# EAGLE board board1 (EAGLE 6.6.0)
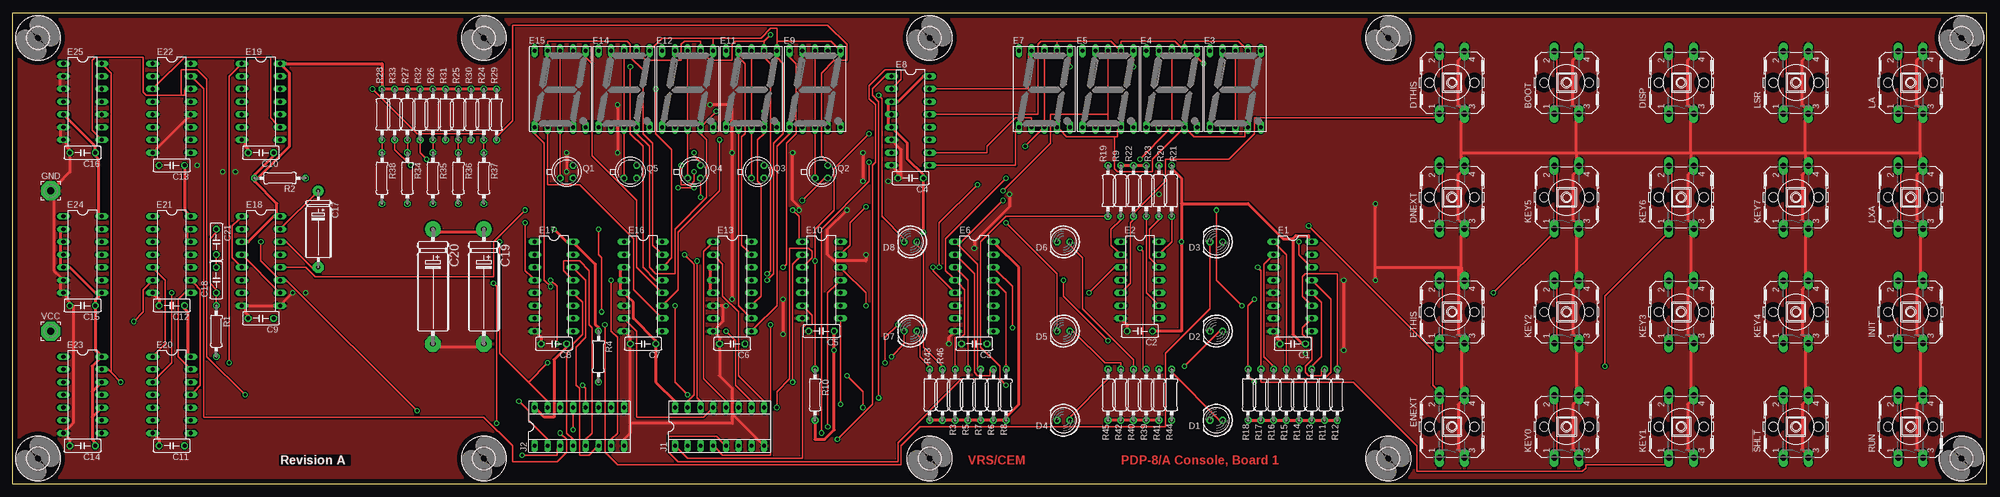
[diagram p4: board, top side]
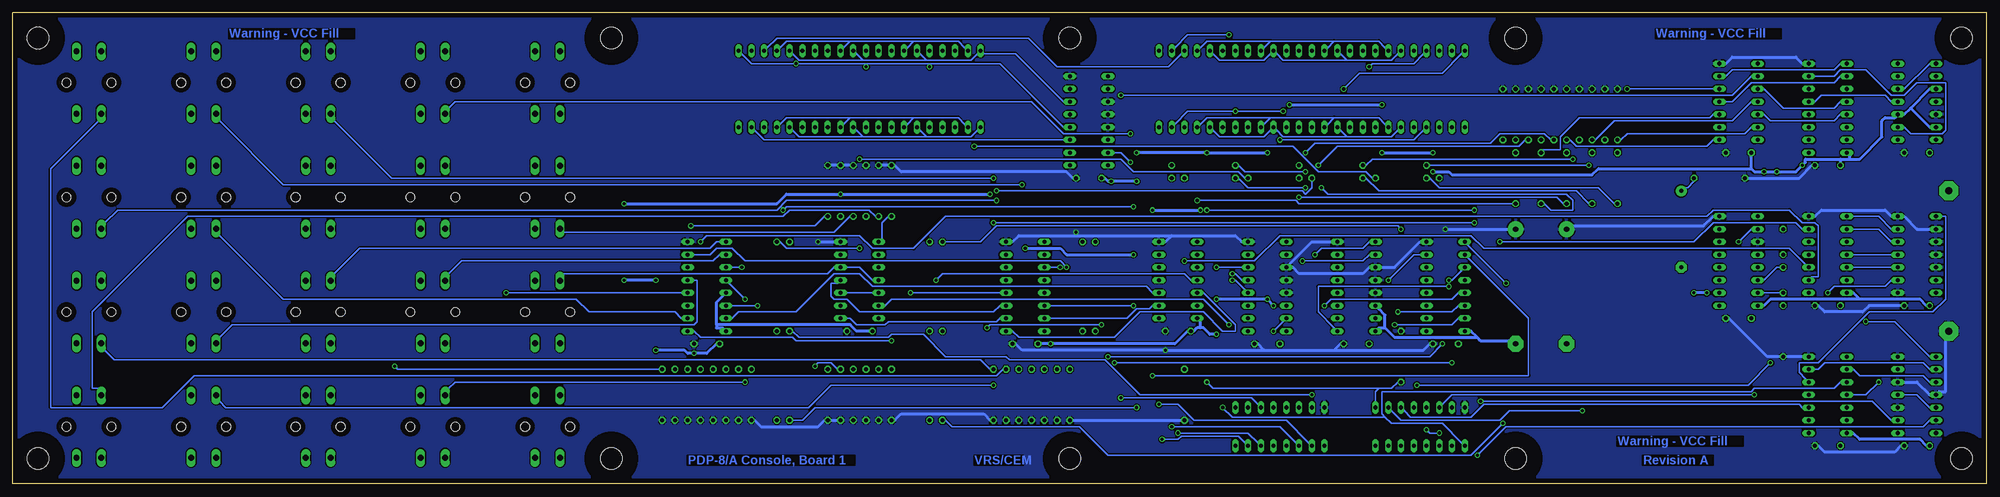
[diagram p5: board, bottom side, seen from below]

Size 393.7 x 93.98 mm. Coordinates in mm from the lower left corner, seen from the top.
Outline: 0,0 0,93.98 393.7,93.98 393.7,0 0,0
Copper layers (1*16): Top 0.035mm / dielectric 1.5mm / Bottom 0.035mm
Design rules "olimex10mil": minimum track width 10mil, minimum drill 24mil, track to track 10mil, track to pad 10mil, pad to pad 10mil, via to via 10mil, smd to smd 10mil, copper to edge 40mil, drill to drill 10mil, minimum pad ring 10mil, minimum via ring 8mil, stop-mask expansion 0mil, vias tented up to drill 0mil, thermal gap 10mil
Net classes: 1 Supply: width 0.635 mm

## Footprints (pad centres in the part's own frame; a part is rotated, then mirrored left to right if it is on the bottom)
B3F-40XX = drill 1.194 long: 1 -6.248,2.489; 2 6.248,2.489; 3 -6.248,-2.489; 4 6.248,-2.489 | hole 1.803: 0,-4.496; 0,4.496
C050-025X075 = drill 0.813 octagon: 1 -2.54,0; 2 2.54,0
E15-5 = drill 0.813 pad 2.159: + -7.62,0 | drill 0.813 pad 2.159 octagon: - 7.62,0
E22-6 = drill 1.016 pad 3.15: + -11.43,0 | drill 1.016 pad 3.15 octagon: - 11.43,0
LED5MM = drill 0.813 octagon: A -1.27,0; K 1.27,0
DIL16 = drill 0.813 long: 1 -8.89,-3.81; 2 -6.35,-3.81; 3 -3.81,-3.81; 4 -1.27,-3.81; 5 1.27,-3.81; 6 3.81,-3.81; 7 6.35,-3.81; 8 8.89,-3.81; 9 8.89,3.81; 10 6.35,3.81; 11 3.81,3.81; 12 1.27,3.81; 13 -1.27,3.81; 14 -3.81,3.81; 15 -6.35,3.81; 16 -8.89,3.81
DIL14 = drill 0.813 long: 1 -7.62,-3.81; 2 -5.08,-3.81; 3 -2.54,-3.81; 4 0,-3.81; 5 2.54,-3.81; 6 5.08,-3.81; 7 7.62,-3.81; 8 7.62,3.81; 9 5.08,3.81; 10 2.54,3.81; 11 0,3.81; 12 -2.54,3.81; 13 -5.08,3.81; 14 -7.62,3.81
HDSP-M = drill 0.813 long: 1 -5.08,-7.62; 2 -2.54,-7.62; 3 0,-7.62; 4 2.54,-7.62; 5 5.08,-7.62; 6 5.08,7.62; 7 2.54,7.62; 8 0,7.62; 9 -2.54,7.62; 10 -5.08,7.62
3,81/1,4 = drill 1.397 pad 3.81 octagon: 1 0,0
SOCKET-16 = drill 0.813 long: 1 -8.89,-3.81; 2 -6.35,-3.81; 3 -3.81,-3.81; 4 -1.27,-3.81; 5 1.27,-3.81; 6 3.81,-3.81; 7 6.35,-3.81; 8 8.89,-3.81; 9 8.89,3.81; 10 6.35,3.81; 11 3.81,3.81; 12 1.27,3.81; 13 -1.27,3.81; 14 -3.81,3.81; 15 -6.35,3.81; 16 -8.89,3.81
TO18 = drill 0.813 octagon: 1 -1.27,-1.27; 2 1.27,-1.27; 3 1.27,1.27
0207/10 = drill 0.813 octagon: 1 -5.08,0; 2 5.08,0
4,3 = hole 4.3: 0,0

## Placement (x,y rotation side)
!SHLT  [B3F-40XX]  355.6,11.43 90 top
BOOT  [B3F-40XX]  309.88,80.01 90 top
C1  0.01  [C050-025X075]  255.27,27.94 180 top
C2  0.01  [C050-025X075]  224.79,30.48 180 top
C3  0.01  [C050-025X075]  191.77,27.94 180 top
C4  0.01  [C050-025X075]  179.07,60.96 180 top
C5  0.01  [C050-025X075]  161.29,30.48 180 top
C6  0.01  [C050-025X075]  143.51,27.94 180 top
C7  0.01  [C050-025X075]  125.73,27.94 180 top
C8  0.01  [C050-025X075]  107.95,27.94 180 top
C9  0.01  [C050-025X075]  49.53,33.02 180 top
C10  0.01  [C050-025X075]  49.53,66.04 180 top
C11  0.01  [C050-025X075]  31.75,7.62 180 top
C12  0.01  [C050-025X075]  31.75,35.56 180 top
C13  0.01  [C050-025X075]  31.75,63.5 180 top
C14  0.01  [C050-025X075]  13.97,7.62 180 top
C15  0.01  [C050-025X075]  13.97,35.56 180 top
C16  0.01  [C050-025X075]  13.97,66.04 180 top
C17  1.0uf  [E15-5]  60.96,50.8 270 top
C18  47pf  [C050-025X075]  40.64,40.64 90 top
C19  220uf  [E22-6]  93.98,39.37 270 top
C20  6.8uf  [E22-6]  83.82,39.37 270 top
C21  33pf  [C050-025X075]  40.64,48.26 270 top
D1  MQ  [LED5MM]  240.03,12.7 180 top
D2  SR  [LED5MM]  240.03,30.48 180 top
D3  MD  [LED5MM]  240.03,48.26 180 top
D4  AC  [LED5MM]  209.55,12.7 180 top
D5  STATUS  [LED5MM]  209.55,30.48 180 top
D6  STATE  [LED5MM]  209.55,48.26 180 top
D7  BUS  [LED5MM]  179.07,30.48 180 top
D8  RUN  [LED5MM]  179.07,48.26 180 top
DISP  [B3F-40XX]  332.74,80.01 90 top
DNEXT  [B3F-40XX]  287.02,57.15 90 top
DTHIS  [B3F-40XX]  287.02,80.01 90 top
E1  74LS148N  [DIL16]  255.27,39.37 270 top
E2  74LS08N  [DIL14]  224.79,40.64 270 top
E3  HD-H101  [HDSP-M]  243.84,78.74 0 top
E4  HD-H101  [HDSP-M]  231.14,78.74 0 top
E5  HD-H101  [HDSP-M]  218.44,78.74 0 top
E6  74LS148N  [DIL16]  191.77,39.37 270 top
E7  HD-H101  [HDSP-M]  205.74,78.74 0 top
E8  7446N  [DIL16]  179.07,72.39 270 top
E9  HD-H101  [HDSP-M]  160.02,78.74 0 top
E10  74LS08N  [DIL14]  161.29,40.64 270 top
E11  HD-H101  [HDSP-M]  147.32,78.74 0 top
E12  HD-H101  [HDSP-M]  134.62,78.74 0 top
E13  7446N  [DIL16]  143.51,39.37 270 top
E14  HD-H101  [HDSP-M]  121.92,78.74 0 top
E15  HD-H101  [HDSP-M]  109.22,78.74 0 top
E16  7446N  [DIL16]  125.73,39.37 270 top
E17  74LS145N  [DIL16]  107.95,39.37 270 top
E18  74LS123N  [DIL16]  49.53,44.45 270 top
E19  7416N  [DIL14]  49.53,76.2 270 top
E20  74LS04N  [DIL14]  31.75,17.78 270 top
E21  74LS20N  [DIL14]  31.75,45.72 270 top
E22  74LS42N  [DIL16]  31.75,74.93 270 top
E23  74LS74N  [DIL14]  13.97,17.78 270 top
E24  74LS95N  [DIL14]  13.97,45.72 270 top
E25  74LS90N  [DIL14]  13.97,76.2 270 top
ENEXT  [B3F-40XX]  287.02,11.43 90 top
ETHIS  [B3F-40XX]  287.02,34.29 90 top
GND  [3,81/1,4]  7.62,58.42 0 top
INIT  [B3F-40XX]  378.46,34.29 90 top
J1  [SOCKET-16]  140.97,11.43 0 top
J2  [SOCKET-16]  113.03,11.43 0 top
KEY0  [B3F-40XX]  309.88,11.43 90 top
KEY1  [B3F-40XX]  332.74,11.43 90 top
KEY2  [B3F-40XX]  309.88,34.29 90 top
KEY3  [B3F-40XX]  332.74,34.29 90 top
KEY4  [B3F-40XX]  355.6,34.29 90 top
KEY5  [B3F-40XX]  309.88,57.15 90 top
KEY6  [B3F-40XX]  332.74,57.15 90 top
KEY7  [B3F-40XX]  355.6,57.15 90 top
LA  [B3F-40XX]  378.46,80.01 90 top
LSR  [B3F-40XX]  355.6,80.01 90 top
LXA  [B3F-40XX]  378.46,57.15 90 top
Q1  MPSA05  [TO18]  110.49,62.23 0 top
Q2  MPSA05  [TO18]  161.29,62.23 0 top
Q3  MPSA05  [TO18]  148.59,62.23 0 top
Q4  MPSA05  [TO18]  135.89,62.23 0 top
Q5  MPSA05  [TO18]  123.19,62.23 0 top
R1  10K  [0207/10]  40.64,30.48 270 top
R2  6.8K  [0207/10]  53.34,60.96 0 top
R3  1K  [0207/10]  187.96,17.78 270 top
R4  10K  [0207/10]  116.84,25.4 270 top
R5  1K  [0207/10]  190.5,17.78 270 top
R6  1K  [0207/10]  195.58,17.78 270 top
R7  1K  [0207/10]  193.04,17.78 270 top
R8  1K  [0207/10]  198.12,17.78 270 top
R9  1K  [0207/10]  220.98,58.42 90 top
R10  1K  [0207/10]  160.02,17.78 270 top
R11  1K  [0207/10]  261.62,17.78 270 top
R12  1K  [0207/10]  264.16,17.78 270 top
R13  1K  [0207/10]  259.08,17.78 270 top
R14  1K  [0207/10]  256.54,17.78 270 top
R15  1K  [0207/10]  254,17.78 270 top
R16  1K  [0207/10]  251.46,17.78 270 top
R17  1K  [0207/10]  248.92,17.78 270 top
R18  1K  [0207/10]  246.38,17.78 270 top
R19  1K  [0207/10]  218.44,58.42 90 top
R20  1K  [0207/10]  228.6,58.42 90 top
R21  1K  [0207/10]  231.14,58.42 90 top
R22  1K  [0207/10]  223.52,58.42 90 top
R23  1K  [0207/10]  226.06,58.42 90 top
R24  470  [0207/10]  93.98,73.66 90 top
R25  470  [0207/10]  88.9,73.66 90 top
R26  470  [0207/10]  83.82,73.66 90 top
R27  470  [0207/10]  78.74,73.66 90 top
R28  470  [0207/10]  73.66,73.66 90 top
R29  10  [0207/10]  96.52,73.66 270 top
R30  10  [0207/10]  91.44,73.66 270 top
R31  10  [0207/10]  86.36,73.66 270 top
R32  10  [0207/10]  81.28,73.66 270 top
R33  27  [0207/10]  76.2,73.66 90 top
R34  27  [0207/10]  78.74,60.96 270 top
R35  27  [0207/10]  83.82,60.96 270 top
R36  27  [0207/10]  88.9,60.96 270 top
R37  27  [0207/10]  93.98,60.96 270 top
R38  27  [0207/10]  73.66,60.96 270 top
R39  330  [0207/10]  226.06,17.78 270 top
R40  330  [0207/10]  223.52,17.78 270 top
R41  330  [0207/10]  228.6,17.78 270 top
R42  330  [0207/10]  220.98,17.78 270 top
R43  330  [0207/10]  182.88,17.78 270 top
R44  330  [0207/10]  231.14,17.78 270 top
R45  330  [0207/10]  218.44,17.78 270 top
R46  330  [0207/10]  185.42,17.78 270 top
RUN  [B3F-40XX]  378.46,11.43 90 top
U$2  [4,3]  5.08,5.08 0 top
U$11  [4,3]  93.98,5.08 0 top
U$12  [4,3]  5.08,88.9 0 top
U$13  [4,3]  182.88,5.08 0 top
U$14  [4,3]  274.32,5.08 0 top
U$15  [4,3]  388.62,5.08 0 top
U$16  [4,3]  388.62,88.9 0 top
U$17  [4,3]  274.32,88.9 0 top
U$18  [4,3]  182.88,88.9 0 top
U$19  [4,3]  93.98,88.9 0 top
VCC  [3,81/1,4]  7.62,30.48 0 top

## Tracks (layer width: path | path; a pad name or v marks a point on that pad's centre or on a via)
!EXTPUL  (via drill 0.61)
  Top 0.254: v155.57,20.32 155.57,43.81 156.84,45.09 E10.2
  Bottom 0.254: 121.28,19.05 118.75,19.05 117.47,20.32 R4.2 | 121.28,19.05 121.92,18.41 121.92,16.51 J2.9 | v155.57,20.32 154.31,19.05 121.28,19.05
!FUN  (via drill 0.61)
  Top 0.254: E21.12 34.92,48.9 34.92,50.16 E21.13 | 102.87,20.32 97.16,26.04 v97.16,48.26 | 102.87,20.32 106.68,16.51 J2.15 | v199.39,31.11 199.39,39.37 196.22,42.55 E6.14 | v176.53,31.75 173.99,29.21 v173.99,24.13 | 102.87,20.32 v106.68,24.13
  Bottom 0.254: v97.16,48.26 58.42,48.26 54.61,52.07 38.1,52.07 36.83,50.8 E21.13 | v199.39,31.11 198.75,31.75 v176.53,31.75 | v106.68,24.13 v173.99,24.13
!KEY-F  (via drill 0.61)
  Top 0.254: v101.6,5.71 108.58,5.71 108.58,6.99 J2.3
  Bottom 0.254: v101.6,5.71 95.89,11.43 12.7,11.43 11.43,12.7 E23.6
!KFUN0  (via drill 0.61)
  Top 0.254: v162.56,11.43 162.56,38.1 164.47,40.01 E10.11
  Bottom 0.254: v162.56,11.43 140.97,11.43 137.79,8.26 J1.3
!KFUN1  (via drill 0.61)
  Top 0.254: v165.1,15.88 165.1,32.38 E10.8
  Bottom 0.254: v165.1,15.88 161.29,15.88 158.12,12.7 139.7,12.7 135.25,8.26 J1.2
!KFUN2
  Top 0.254: J1.1 132.72,6.99 134.62,5.08 157.48,5.08 157.48,31.11 158.12,31.75 159.38,31.75 159.38,33.66 158.12,34.92 E10.6
!MCLOCK  (via drill 0.61)
  Top 0.254: v31.75,38.1 31.75,24.13 28.57,20.95 E20.3 | v152.4,15.24 152.4,18.41 154.94,20.95 154.94,46.99 158.75,46.99 159.38,46.35 159.38,45.09 158.12,43.81 E10.3
  Bottom 0.254: v31.75,38.1 30.48,39.37 20.32,39.37 19.05,40.64 E24.9 | 120.02,13.34 120.65,13.97 120.65,18.41 46.99,18.41 46.35,19.05 30.48,19.05 29.21,20.32 E20.3 | 120.02,13.34 118.75,12.06 108.58,12.06 104.78,8.26 J2.1 | v152.4,15.24 150.5,13.34 120.02,13.34
!SHLT  (via drill 0.61)
  Top 0.254: !SHLT.1 353.69,6.35 353.69,16.51 !SHLT.2 | 196.85,20.95 189.23,20.95 176.53,8.26 176.53,4.45 132.72,4.45 130.81,6.35 130.81,9.53 140.34,9.53 141.6,8.26 J1.5 | 196.85,20.95 196.85,23.5 193.04,27.3 193.04,48.26 198.12,53.34 217.81,53.34 R19.1 | 196.85,20.95 v198.12,19.68
  Bottom 0.254: E2.1 220.34,48.9 220.34,52.07 219.07,53.34 R19.1 | v198.12,19.68 230.5,19.68 234.95,15.24 351.15,15.24 352.43,16.51 !SHLT.2
!STHIS  (via drill 0.61)
  Top 0.254: v151.13,31.75 151.13,5.71 141.6,5.71 140.34,6.99 J1.4
  Bottom 0.254: v151.13,31.75 156.21,36.83 218.44,36.83 219.71,35.56 E2.6
AA  (via drill 0.61)
  Top 0.254: E14.7 125.09,85.72 126.36,84.45 133.35,84.45 133.35,87.63 133.99,88.27 137.16,88.27 137.16,87.63 E12.7 137.79,85.72 139.06,84.45 143.51,84.45 143.51,87.63 144.15,88.27 149.86,88.27 | v150.5,41.91 151.13,42.55 151.13,83.82 149.86,85.09 E11.7 149.86,87.63 149.86,88.27 | 149.86,88.27 v151.13,89.53
  Bottom 0.254: v150.5,41.91 149.86,41.91 148.59,40.64 E13.13 | v151.13,89.53 159.38,89.53 161.93,87 E9.7
AB  (via drill 0.61)
  Top 0.254: 139.7,88.9 129.54,88.9 127.64,87 E14.6 | 139.7,88.9 139.7,87.63 E12.6 | v150.5,40.64 151.76,41.91 151.76,67.94 153.67,69.85 153.67,83.82 152.4,85.09 E11.6 152.4,87.63 152.4,88.27 | 152.4,88.27 163.19,88.27 164.47,87 E9.6 | 139.7,88.9 149.22,88.9 151.13,90.81 152.4,90.81 152.4,88.27
  Bottom 0.254: v150.5,40.64 149.86,40.64 147.96,38.73 E13.12
AC  (via drill 0.61)
  Top 0.254: E14.4 124.46,69.85 127,67.31 127,43.18 128.27,41.91 132.08,41.91 132.08,50.8 138.43,57.15 138.43,68.58 137.16,69.85 E12.4 137.79,71.75 v140.34,74.3 | E13.11 147.96,36.2 149.22,37.47 149.22,59.69 148.59,60.33 148.59,68.58 149.86,69.85 E11.4 149.86,72.39 v149.86,74.3
  Bottom 0.254: E9.4 161.93,71.75 159.38,74.3 v149.86,74.3 v140.34,74.3
AD
  Top 0.254: E13.10 146.69,33.66 144.78,35.56 144.78,69.85 E11.2
  Bottom 0.254: 130.18,73.03 121.28,73.03 120.02,71.75 E14.2 | 130.18,73.03 131.44,71.75 E12.2 | 142.88,73.03 144.15,71.75 E11.2 | 142.88,73.03 130.18,73.03 | 142.88,73.03 155.57,73.03 156.84,71.75 E9.2
ADDR0
  Top 0.254: J1.9 149.86,16.51 144.78,21.59 144.78,34.29 141.6,37.47 141.6,43.81 140.34,45.09 E13.2
ADDR1
  Top 0.254: J1.12 142.24,16.51 137.79,20.95 137.79,46.35 139.06,47.62 E13.1
ADDR2  (via drill 0.61)
  Top 0.254: v142.24,30.48 144.15,28.57 144.15,19.68 147.32,16.51 J1.10
  Bottom 0.254: v142.24,30.48 140.34,32.38 E13.7
AE
  Top 0.254: E13.9 147.96,31.11 152.4,35.56 152.4,67.31 154.94,69.85 E9.1
  Bottom 0.254: 127.64,69.22 118.75,69.22 117.47,70.48 E14.1 | 127.64,69.22 128.91,70.48 E12.1 | 127.64,69.22 140.34,69.22 141.6,70.48 E11.1 142.88,70.48 144.15,69.22 153.03,69.22 154.31,70.48 E9.1
AF
  Top 0.254: E13.15 146.69,46.35 145.41,47.62 145.41,69.22 146.05,69.85 146.05,83.82 144.78,85.09 E11.9
  Bottom 0.254: 130.18,88.27 121.28,88.27 120.02,87 E14.9 | 130.18,88.27 131.44,87 E12.9 | 142.88,88.27 144.15,87 E11.9 | 142.88,88.27 130.18,88.27 | 142.88,88.27 155.57,88.27 156.84,87 E9.9
AG  (via drill 0.61)
  Top 0.254: v153.67,43.18 154.31,43.81 154.31,67.94 156.21,69.85 156.21,83.82 154.94,85.09 E9.10
  Bottom 0.254: 127.64,84.45 118.75,84.45 117.47,85.72 E14.10 | 127.64,84.45 128.91,85.72 E12.10 | 127.64,84.45 140.34,84.45 141.6,85.72 E11.10 142.88,85.72 144.15,84.45 153.03,84.45 154.31,85.72 E9.10 | v153.67,43.18 148.59,43.18 E13.14
BEMA0  (via drill 0.61)
  Top 0.254: v136.53,44.45 136.53,17.14 137.16,16.51 J1.14
  Bottom 0.254: v136.53,44.45 124.46,44.45 123.19,45.72 E16.2
BEMA1  (via drill 0.61)
  Top 0.254: v133.99,45.72 135.89,43.81 135.89,17.78 134.62,16.51 J1.15
  Bottom 0.254: v133.99,45.72 132.72,46.99 124.46,46.99 123.19,48.26 E16.1
BEMA2
  Top 0.254: J1.13 139.06,14.61 137.79,13.34 124.46,13.34 124.46,30.48 122.56,32.38 E16.7
BOOT  (via drill 0.61)
  Top 0.254: BOOT.1 307.98,74.93 307.98,85.09 BOOT.2 | R10.1 160.02,23.5 v160.02,44.45 160.02,50.8 163.83,54.61 163.83,62.87 v170.81,69.85
  Bottom 0.254: v160.02,44.45 146.05,44.45 140.97,49.53 102.87,49.53 100.33,46.99 39.37,46.99 36.2,43.81 E21.10 | v170.81,69.85 184.15,69.85 190.5,76.2 305.44,76.2 306.7,74.93 BOOT.1
BPWR-OK  (via drill 0.61)
  Top 0.254: v49.53,48.26 49.53,44.45 52.7,41.27 E18.11 54.61,40.64 v80.64,14.61
  Bottom 0.254: v49.53,48.26 46.99,50.8 E18.2 | v80.64,14.61 95.25,14.61 97.16,12.7 116.84,12.7 118.75,14.61 J2.10
BRUN  (via drill 0.61)
  Top 0.254: v43.18,24.13 43.18,81.28 45.09,83.19 E19.1 | v113.67,19.68 114.3,19.05 114.3,16.51 J2.12
  Bottom 0.254: v43.18,24.13 47.62,19.68 v113.67,19.68
DA
  Top 0.254: 208.28,88.27 205.1,88.27 204.47,87.63 204.47,73.66 184.15,73.66 E8.13 | 208.28,88.27 208.28,87.63 E7.7 | 208.28,88.27 219.07,88.27 220.34,87 E5.7 220.98,87.63 220.98,88.27 231.78,88.27 233.04,87 E4.7 233.68,87.63 233.68,88.27 244.47,88.27 245.75,87 E3.7
DB  (via drill 0.61)
  Top 0.254: v210.82,83.19 210.82,85.09 E7.6 | v223.52,83.19 223.52,85.09 E5.6 | v237.49,83.82 236.22,85.09 E4.6
  Bottom 0.254: 223.52,83.82 v237.49,83.82 246.38,83.82 248.28,85.72 E3.6 | 210.82,83.82 223.52,83.82 | 210.82,83.82 196.85,83.82 184.15,71.12 E8.12 | 210.82,83.82 v210.82,83.19 | 223.52,83.82 v223.52,83.19
DC
  Top 0.254: 219.71,69.22 220.34,69.22 220.34,70.48 E5.4 | 219.71,69.22 210.19,69.22 208.91,70.48 E7.4 | E3.4 245.75,70.48 245.75,69.22 235.59,69.22 234.31,70.48 E4.4 233.04,70.48 227.33,64.77 227.33,62.23 220.34,62.23 219.71,62.87 219.71,69.22
  Bottom 0.254: E8.11 184.15,68.58 243.84,68.58 245.75,70.48 E3.4
DD
  Top 0.254: E8.10 184.15,66.04 194.31,66.04 194.31,67.31 200.03,73.03 203.2,73.03 203.2,72.39 E7.2
  Bottom 0.254: 214,73.03 215.26,71.75 E5.2 | 214,73.03 205.1,73.03 203.84,71.75 E7.2 | 226.69,73.03 227.97,71.75 E4.2 | 214,73.03 226.69,73.03 | 226.69,73.03 239.4,73.03 240.66,71.75 E3.2
DE
  Top 0.254: E8.9 184.15,63.5 200.03,63.5 200.03,70.48 E7.1
  Bottom 0.254: 211.46,69.22 212.72,70.48 E5.1 | 211.46,69.22 202.56,69.22 201.29,70.48 E7.1 | 224.16,69.22 225.43,70.48 E4.1 | 211.46,69.22 224.16,69.22 | 224.16,69.22 236.85,69.22 238.12,70.48 E3.1
DF
  Top 0.254: E8.15 184.15,78.74 202.56,78.74 202.56,85.72 E7.9
  Bottom 0.254: 214,88.27 215.26,87 E5.9 | 214,88.27 205.1,88.27 203.84,87 E7.9 | 226.69,88.27 227.97,87 E4.9 | 214,88.27 226.69,88.27 | 226.69,88.27 239.4,88.27 240.66,87 E3.9
DG
  Bottom 0.254: E8.14 184.15,76.2 193.68,85.72 200.03,85.72 E7.10 201.29,85.72 202.56,84.45 211.46,84.45 | 211.46,84.45 212.72,85.72 E5.10 | 224.16,84.45 225.43,85.72 E4.10 | 211.46,84.45 224.16,84.45 | 224.16,84.45 236.85,84.45 238.12,85.72 E3.10
DISP  (via drill 0.61)
  Top 0.254: DISP.1 330.83,74.93 330.83,85.09 DISP.2 | R3.1 187.96,23.5 187.96,29.21 189.23,29.21 189.87,29.84 189.87,38.73 188.59,40.01 E6.4 187.32,41.27 186.06,42.55 186.06,48.9 v198.12,60.96
  Bottom 0.254: v198.12,60.96 318.13,60.96 329.56,72.39 DISP.1
DISP0
  Top 0.254: J2.5 114.3,8.89 115.57,10.16 115.57,31.11 114.94,31.75 114.94,42.55 113.03,44.45 109.86,44.45 109.86,42.55 111.12,41.27 E17.13
DISP1
  Top 0.254: J2.6 116.2,6.99 114.94,5.71 113.03,5.71 113.03,19.05 112.39,19.68 112.39,27.3 114.3,29.21 114.3,40.64 112.39,42.55 E17.14
DISP2  (via drill 0.61)
  Top 0.254: v119.38,40.64 119.38,30.48 120.65,29.21 120.65,10.16 119.38,8.89 J2.7
  Bottom 0.254: v119.38,40.64 114.3,45.72 113.03,45.72 E17.15
DISPINH
  Top 0.254: J2.4 111.76,8.89 110.49,10.16 110.49,26.04 111.76,27.3 111.76,27.94 113.67,29.84 113.67,36.2 112.39,37.47 E17.12
DISPLAY0  (via drill 0.61)
  Top 0.254: v164.47,8.89 171.45,15.88 171.45,63.5 172.09,64.14 172.09,75.56 170.81,76.83 170.81,79.38 173.99,82.55 177.16,82.55 177.16,80.64 175.9,79.38 E8.2
  Bottom 0.254: v164.47,8.89 161.29,8.89 160.66,9.53 149.22,9.53 147.96,8.26 J1.7
DISPLAY1  (via drill 0.61)
  Top 0.254: v172.72,17.14 172.72,76.2 171.45,77.47 171.45,78.74 173.99,81.28 E8.1
  Bottom 0.254: v172.72,17.14 146.69,17.14 145.41,15.88 J1.11
DISPLAY2  (via drill 0.61)
  Top 0.254: v161.29,10.16 161.29,50.8 170.81,60.33 v170.81,64.14
  Bottom 0.254: v161.29,10.16 147.32,10.16 145.41,8.26 J1.6 | v170.81,64.14 172.72,66.04 173.99,66.04 E8.7
DNEXT
  Top 0.254: DNEXT.1 285.12,52.07 285.12,62.23 DNEXT.2 | E2.9 227.97,36.2 226.06,38.1 226.06,52.7 R23.1
  Bottom 0.254: DNEXT.1 283.85,50.16 229.87,50.16 226.69,53.34 R23.1
DTHIS
  Top 0.254: DTHIS.2 285.12,85.09 285.12,74.93 DTHIS.1 283.85,73.03 247.65,73.03 247.65,69.85 242.57,64.77 229.87,64.77 229.87,60.33 223.52,53.98 R22.1 223.52,52.7 222.88,52.07 222.88,40.01 221.62,38.73 E2.5
  Bottom 0.254: E2.5 222.25,38.1 227.33,38.1 E2.10
ENEXT  (via drill 0.61)
  Top 0.254: E2.13 229.24,46.35 231.14,48.26 231.14,52.7 R21.1 | ENEXT.1 285.12,6.35 285.12,16.51 ENEXT.2 283.85,19.05 283.21,19.68 283.21,26.67 v258.44,51.44
  Bottom 0.254: v258.44,51.44 233.68,51.44 231.78,53.34 R21.1
ETHIS
  Top 0.254: ETHIS.1 285.12,29.21 285.12,39.37 ETHIS.2 | R20.1 228.6,52.7 226.69,50.8 226.69,45.09 227.97,43.81 E2.12
  Bottom 0.254: E2.4 222.25,40.64 224.79,43.18 227.33,43.18 E2.12 229.87,43.18 231.14,41.91 283.85,41.91 ETHIS.2
GND  (via drill 0.61)
  Top 0.635: v110.49,66.04 v110.49,62.23 | v120.65,75.56 v120.65,66.04 | v139.06,75.56 143.51,75.56 v143.51,66.04 v143.51,36.83 | v169.54,66.04 v169.54,60.33 | v153.67,36.83 v153.67,29.84 | v155.57,66.04 155.57,56.52 156.84,55.24 v156.84,54.61 | v166.37,54.61 162.56,50.8 162.56,45.72 163.83,44.45 170.18,44.45 v170.18,45.72 | v191.77,46.99 191.77,48.26 198.75,55.24 v198.75,57.78 | 271.78,43.18 v271.78,55.88 | v271.78,40.64 271.78,43.18 | v265.43,26.67 v265.43,40.64 | 380.37,66.04 380.37,72.39 LA.3 380.37,74.93 379.73,75.56 379.73,84.45 380.37,85.09 LA.4 | 380.37,66.04 380.37,64.77 LXA.4 380.37,62.23 379.73,61.59 379.73,52.7 380.37,52.07 LXA.3 380.37,49.53 380.37,41.91 INIT.4 380.37,39.37 379.73,38.73 379.73,29.84 380.37,29.21 INIT.3 380.37,26.67 380.37,19.05 RUN.4 380.37,16.51 379.73,15.88 379.73,6.99 380.37,6.35 RUN.3 | 357.5,66.04 357.5,72.39 LSR.3 357.5,74.93 356.87,75.56 356.87,84.45 357.5,85.09 LSR.4 | 357.5,66.04 357.5,64.77 KEY7.4 357.5,62.23 356.87,61.59 356.87,52.7 357.5,52.07 KEY7.3 357.5,49.53 357.5,41.91 KEY4.4 357.5,39.37 356.87,38.73 356.87,29.84 357.5,29.21 KEY4.3 357.5,26.67 357.5,19.05 !SHLT.4 357.5,16.51 356.87,15.88 356.87,6.99 357.5,6.35 !SHLT.3 | 334.64,66.04 334.64,72.39 DISP.3 334.64,74.93 334.01,75.56 334.01,84.45 334.64,85.09 DISP.4 | 334.64,66.04 334.64,64.77 KEY6.4 334.64,62.23 334.01,61.59 334.01,52.7 334.64,52.07 KEY6.3 334.64,49.53 334.64,41.91 KEY3.4 334.64,39.37 334.01,38.73 334.01,29.84 334.64,29.21 KEY3.3 334.64,26.67 334.64,19.05 KEY1.4 334.64,16.51 334.01,15.88 334.01,6.99 334.64,6.35 KEY1.3 | 311.79,66.04 311.79,72.39 BOOT.3 311.79,74.93 311.15,75.56 311.15,84.45 311.79,85.09 BOOT.4
  Top 0.635: 311.79,66.04 311.79,64.77 KEY5.4 311.79,62.23 311.15,61.59 311.15,52.7 311.79,52.07 KEY5.3 311.79,49.53 311.79,41.91 KEY2.4 311.79,39.37 311.15,38.73 311.15,29.84 311.79,29.21 KEY2.3 311.79,26.67 311.79,19.05 KEY0.4 311.79,16.51 311.15,15.88 311.15,6.99 311.79,6.35 KEY0.3 | C14.2 11.43,8.26 11.43,8.89 10.79,9.53 E23.7 10.79,10.79 12.06,12.06 12.06,35.56 C15.2 11.43,36.2 10.79,36.83 10.79,37.47 E24.7 9.53,38.73 9.53,40.01 E24.6 9.53,41.27 8.26,42.55 8.26,57.15 GND.1 8.89,59.69 11.43,62.23 11.43,65.41 C16.2 11.43,66.67 10.79,67.31 10.79,67.94 E25.7 9.53,69.22 9.53,70.48 E25.6 | E20.7 28.57,9.53 29.21,8.89 29.21,8.26 C11.2 | v55.88,38.1 53.98,36.2 E18.9 52.07,35.56 46.99,35.56 E18.8 46.35,34.92 46.35,34.29 46.99,33.66 C9.2 | E21.7 28.57,37.47 29.21,36.83 29.21,36.2 C12.2 | 123.19,12.06 123.19,27.3 C7.2 123.19,28.57 123.19,29.21 122.56,29.84 E16.8 | 123.19,12.06 123.19,10.16 121.92,8.89 J2.8 | E17.8 104.78,29.84 105.41,29.21 105.41,28.57 C8.2 | C20.- 85.09,27.3 92.71,27.3 C19.- | E2.7 221.62,32.38 222.25,31.75 222.25,31.11 C2.2 | C1.2 252.73,28.57 252.09,29.21 252.09,29.84 E1.8 | 143.51,13.97 149.22,8.26 J1.8 | 143.51,13.97 143.51,19.05 140.97,21.59 140.97,27.3 C6.2 140.97,28.57 140.97,29.21 140.34,29.84 E13.8 140.34,31.11 141.6,32.38 141.6,35.56 | 288.93,66.04 288.93,72.39 DTHIS.3 288.93,74.93 288.29,75.56 288.29,84.45 288.93,85.09 DTHIS.4 | 288.93,66.04 288.93,64.77 DNEXT.4 288.93,62.23 288.29,61.59 288.29,52.7 288.93,52.07 DNEXT.3 288.93,49.53 288.93,43.18 | ENEXT.3 288.93,6.35 288.29,6.99 288.29,15.88 288.93,16.51 ENEXT.4 288.93,19.05 288.93,26.67 ETHIS.3 288.93,29.21 288.29,29.84 288.29,43.18
  Top 0.635: 288.93,43.18 288.93,41.91 ETHIS.4 | C10.2 46.99,66.67 46.35,67.31 46.35,67.94 E19.7 | E25.3 9.53,79.38 9.53,80.64 E25.2 | E22.12 34.92,73.03 28.57,66.67 E22.8 | v142.24,35.56 141.6,35.56 | 141.6,35.56 140.97,35.56 E13.6 | E8.8 175.9,62.87 176.53,62.23 176.53,61.59 C4.2 177.16,60.96 177.16,66.67 175.9,67.94 E8.6 | v186.69,27.94 186.69,29.21 187.32,29.84 E6.8 | 271.78,43.18 288.29,43.18 | 288.29,43.18 288.93,43.18 | 123.19,12.06 143.51,12.06 143.51,13.97 | 288.93,66.04 311.79,66.04 | 311.79,66.04 334.64,66.04 | 334.64,66.04 357.5,66.04 | 357.5,66.04 380.37,66.04
  Bottom 0.635: v55.88,38.1 v58.42,38.1 | 29.21,64.77 36.2,64.77 36.2,64.14 v36.83,63.5 38.1,62.23 v41.91,62.23 v44.45,62.23 46.35,62.23 46.99,62.87 | 29.21,64.77 27.3,64.77 | 27.3,64.77 25.4,64.77 20.95,69.22 20.95,72.39 20.32,73.03 18.41,73.03 E25.10 16.51,73.66 15.24,74.93 | 46.99,62.87 77.47,62.87 78.74,61.59 106.68,61.59 107.31,62.23 v110.49,62.23 | v120.65,66.04 v110.49,66.04 | v139.06,75.56 v120.65,75.56 | v142.24,35.56 v143.51,36.83 v153.67,36.83 | v169.54,66.04 v155.57,66.04 v143.51,66.04 | v169.54,60.33 v174.62,60.33 175.26,60.33 175.9,60.96 C4.2 | v153.67,29.84 154.94,29.84 156.21,31.11 156.84,31.11 | 156.84,31.11 156.84,32.38 E10.7 | v166.37,54.61 v156.84,54.61 | v170.18,45.72 183.51,45.72 184.78,46.99 v191.77,46.99 | v198.75,57.78 v228.6,57.78 239.4,57.78 241.3,55.88 v271.78,55.88 | v265.43,40.64 v271.78,40.64 | v265.43,26.67 259.71,26.67 259.08,26.04 v257.81,26.04 255.27,26.04 253.37,27.94 C1.2 | C14.2 12.06,7.62 13.34,8.89 25.4,8.89 26.67,10.16 E20.7 | 25.4,36.83 26.67,38.1 E21.7 | 25.4,36.83 13.34,36.83 12.06,35.56 C15.2 | 25.4,36.83 43.18,36.83 44.45,35.56 E18.8 | 120.02,31.11 120.02,33.66 121.28,34.92 E16.6 | 120.02,31.11 121.28,31.11 E16.8 | 101.6,29.21 100.97,28.57 95.25,28.57 C19.- | 101.6,29.21 102.87,30.48 E17.8 | 120.02,31.11 118.11,29.21 101.6,29.21 | 253.37,31.75 253.37,31.11 252.09,31.11 E1.8 | 253.37,31.75 253.37,36.2 252.09,37.47 E1.5 | 253.37,31.75 226.69,31.75 225.43,30.48 222.88,30.48 C2.2 | 27.3,64.77 27.3,65.41 E22.8 | 29.21,64.77 29.21,64.14 C13.2 | 156.84,31.11 157.48,31.11 158.12,30.48 C5.2 159.38,30.48 161.93,27.94 v186.69,27.94 188.59,27.94 C3.2
  Bottom 0.635: 15.24,74.93 11.43,78.74 E25.3 | 46.99,62.87 46.99,65.41 C10.2 | 15.24,74.93 11.43,71.12 E25.6
  pour Top (isolate 0.254): 0,0 0,93.98 393.7,93.98 393.7,0
INIT
  Top 0.254: INIT.1 376.56,29.21 376.56,39.37 INIT.2 | E6.13 196.22,40.01 198.12,38.1 198.12,23.5 R8.1
  Bottom 0.254: INIT.1 375.29,26.67 373.38,24.77 200.66,24.77 198.75,22.86 R8.1
KEY0  (via drill 0.61)
  Top 0.254: KEY0.1 307.98,6.35 307.98,16.51 KEY0.2 | v247.65,36.83 246.38,35.56 246.38,23.5 R18.1 246.38,22.23 246.38,21.59 v247.65,20.32
  Bottom 0.254: v247.65,36.83 250.82,40.01 E1.4 | v247.65,20.32 305.44,20.32 306.7,19.05 KEY0.2
KEY1  (via drill 0.61)
  Top 0.254: KEY1.2 330.83,16.51 330.83,6.35 KEY1.1 329.56,3.81 313.69,3.81 313.69,3.17 313.06,2.54 280.04,2.54 280.04,7.62 267.33,20.32 248.92,20.32 248.92,22.23 R17.1 248.92,23.5 248.92,42.55 v248.28,43.18
  Bottom 0.254: v248.28,43.18 250.19,43.18 E1.3
KEY2
  Top 0.254: KEY2.1 307.98,29.21 307.98,39.37 KEY2.2 | E1.2 250.82,45.09 249.56,43.81 249.56,25.4 251.46,23.5 R16.1
  Bottom 0.254: KEY2.2 306.7,41.91 304.17,44.45 254,44.45 252.73,45.72 E1.2
KEY3
  Top 0.254: KEY3.1 330.83,29.21 330.83,39.37 KEY3.2 | E1.1 252.09,47.62 254,45.72 254,23.5 R15.1
  Bottom 0.254: KEY3.2 329.56,41.91 324.49,46.99 254.63,46.99 253.37,48.26 252.73,48.26 E1.1
KEY4
  Top 0.254: KEY4.1 353.69,29.21 353.69,39.37 KEY4.2 | E1.13 259.71,40.01 262.89,36.83 262.89,22.23 261.62,20.95 256.54,20.95 256.54,22.23 R14.1
  Bottom 0.254: KEY4.1 352.43,29.21 349.88,31.75 257.81,31.75 257.18,32.38 257.18,40.64 257.81,40.64 E1.13
KEY5  (via drill 0.61)
  Top 0.254: KEY5.2 307.98,62.23 307.98,52.07 KEY5.1 306.7,49.53 v295.27,38.1 | E1.12 259.71,37.47 260.99,36.2 260.99,25.4 259.08,23.5 R13.1
  Bottom 0.254: v295.27,38.1 260.35,38.1 E1.12
KEY6  (via drill 0.61)
  Top 0.254: KEY6.2 330.83,62.23 330.83,52.07 KEY6.1 329.56,49.53 317.5,37.47 v317.5,23.5 | E1.11 258.44,36.2 257.18,37.47 257.18,41.27 257.81,41.91 264.16,41.91 264.16,23.5 R12.1
  Bottom 0.254: v317.5,23.5 316.87,22.86 264.8,22.86 R12.1
KEY7
  Top 0.254: E1.10 258.44,32.38 257.18,31.11 257.18,29.84 257.81,29.21 259.08,29.21 259.08,24.77 257.81,23.5 257.81,22.23 258.44,21.59 260.99,21.59 260.99,22.86 R11.1 | KEY7.1 353.69,52.07 353.69,62.23 KEY7.2
  Bottom 0.254: E1.10 260.35,33.02 261.62,34.29 278.76,34.29 281.31,36.83 339.73,36.83 352.43,49.53 KEY7.1
KEYSTB  (via drill 0.61)
  Top 0.254: v100.97,16.51 102.87,14.61 102.87,12.7 106.68,8.89 J2.2
  Bottom 0.254: v100.97,16.51 22.86,16.51 19.05,12.7 E23.9
LA
  Top 0.254: LA.1 376.56,74.93 376.56,85.09 LA.2 | E6.2 188.59,45.09 191.77,41.91 191.77,22.23 192.41,21.59 194.94,21.59 194.94,22.86 R6.1
  Bottom 0.254: LA.1 376.56,72.39 386.08,62.87 386.08,15.24 363.86,15.24 357.5,21.59 197.49,21.59 196.22,22.86 R6.1
LSR  (via drill 0.61)
  Top 0.254: LSR.1 353.69,74.93 353.69,85.09 LSR.2 | E6.3 188.59,42.55 190.5,40.64 190.5,23.5 R5.1 | v192.41,59.69 184.78,52.07 v184.78,43.18
  Bottom 0.254: v192.41,59.69 339.73,59.69 352.43,72.39 LSR.1 | v184.78,43.18 186.69,43.18 E6.3
LXA  (via drill 0.61)
  Top 0.254: LXA.1 376.56,52.07 376.56,62.23 LXA.2 | R7.1 192.41,22.86 192.41,43.81 188.59,47.62 E6.1 189.23,48.26 v197.49,56.52
  Bottom 0.254: v197.49,56.52 239.4,56.52 241.3,54.61 372.75,54.61 375.29,52.07 LXA.1
MCLOCK  (via drill 0.61)
  Top 0.254: 19.68,22.23 v21.59,20.32 | 19.68,22.23 19.05,22.86 E23.13 | 19.68,22.23 19.68,81.92 18.41,83.19 E25.14
  Bottom 0.254: v21.59,20.32 24.13,17.78 26.67,17.78 E20.4
MPXA  (via drill 0.61)
  Top 0.254: 33.66,77.47 34.29,77.47 34.29,78.74 E22.14 | 33.66,77.47 26.67,77.47 26.04,78.11 26.04,85.09 16.51,85.09 15.88,84.45 15.88,70.48 17.14,69.22 E25.8 | v46.35,17.78 38.73,25.4 38.73,80.64 36.83,82.55 33.66,82.55 33.66,77.47
  Bottom 0.254: v46.35,17.78 106.68,17.78 108.58,15.88 J2.14
MPXB  (via drill 0.61)
  Top 0.254: v111.76,10.79 111.76,13.97 J2.13 | v109.22,10.16 110.49,8.89 110.49,6.35 108.58,4.45 99.69,4.45 99.69,7.62 93.98,13.34 38.1,13.34 38.1,78.74 36.2,80.64 E22.15
  Bottom 0.254: E25.9 16.51,71.12 15.24,69.85 8.89,69.85 8.26,70.48 8.26,80.01 13.97,80.01 16.51,77.47 19.05,77.47 24.13,82.55 29.21,82.55 30.48,81.28 34.29,81.28 E22.15 | v111.76,10.79 111.12,10.16 v109.22,10.16
N$1  (via drill 0.61)
  Top 0.254: v245.11,35.56 240.03,40.64 v240.03,54.61 | v170.18,55.24 167,52.07 167,47.62 165.74,46.35 E10.13
  Bottom 0.254: v245.11,35.56 250.19,35.56 E1.6 | v240.03,54.61 239.4,55.24 v170.18,55.24
N$2
  Bottom 0.254: E1.7 250.19,33.02 248.92,34.29 237.49,34.29 229.87,41.91 224.79,41.91 222.25,39.37 167.64,39.37 166.37,38.1 E10.10
N$3  (via drill 0.61)
  Top 0.254: v218.44,28.57 209.55,37.47 v209.55,40.64
  Bottom 0.254: v218.44,28.57 237.49,28.57 238.12,29.21 256.54,29.21 257.81,30.48 E1.9 | v209.55,40.64 208.28,41.91 160.02,41.91 158.75,40.64 E10.4
N$4  (via drill 0.61)
  Top 0.254: E20.11 36.2,18.41 37.47,19.68 37.47,38.73 36.2,40.01 E21.9 | v256.54,48.26 256.54,45.72 258.44,43.81 E1.14
  Bottom 0.254: v256.54,48.26 255.27,49.53 224.79,49.53 222.25,46.99 214,46.99 207.65,53.34 55.88,53.34 54.61,54.61 39.37,54.61 36.83,52.07 34.29,52.07 33.66,51.44 33.66,41.27 34.92,41.27 E21.9
N$5  (via drill 0.61)
  Top 0.254: v170.18,35.56 170.18,38.1 165.74,42.55 E10.12
  Bottom 0.254: v170.18,35.56 186.69,35.56 E6.6
N$6
  Bottom 0.254: E10.9 166.37,35.56 167,34.92 169.54,34.92 171.45,33.02 186.69,33.02 E6.7
N$7
  Bottom 0.254: E10.5 156.21,38.1 149.86,31.75 149.86,30.48 152.4,30.48 156.21,34.29 168.91,34.29 173.99,29.21 193.04,29.21 194.31,30.48 E6.9
N$8  (via drill 0.61)
  Top 0.254: v183.51,43.18 183.51,42.55 187.32,38.73 E6.5
  Bottom 0.254: v183.51,43.18 184.78,44.45 247.65,44.45 250.19,46.99 253.37,46.99 254.63,45.72 257.81,45.72 E1.15
N$9
  Bottom 0.254: E24.13 19.05,50.8 21.59,53.34 26.67,53.34 E21.1
N$10
  Bottom 0.254: E24.12 19.05,48.26 21.59,50.8 26.67,50.8 E21.2
N$11
  Bottom 0.254: E24.11 19.05,45.72 26.67,45.72 E21.4
N$12
  Top 0.254: E20.1 28.57,26.04 30.48,27.94 30.48,40.64 28.57,42.55 E21.5
  Bottom 0.254: E24.10 19.05,43.18 26.67,43.18 E21.5
N$13  (via drill 0.61)
  Top 0.254: v24.13,32.38 26.04,34.29 26.04,38.73 27.3,40.01 E21.6
  Bottom 0.254: v24.13,32.38 18.41,32.38 11.43,25.4 E23.1
N$14
  Bottom 0.254: E23.3 11.43,20.32 12.7,21.59 25.4,21.59 26.67,22.86 E20.2
N$15
  Top 0.254: E21.8 34.29,38.1 33.02,36.83 33.02,25.4 34.92,23.5 E20.13
  Bottom 0.254: E23.2 11.43,22.86 12.7,24.13 32.38,24.13 33.66,22.86 34.29,22.86 E20.13
N$16
  Bottom 0.254: E20.12 36.2,20.95 37.47,22.23 37.47,24.13 33.66,24.13 23.5,34.29 10.79,34.29 8.26,36.83 8.26,53.34 8.89,53.34 E24.1
N$17
  Bottom 0.254: E23.5 11.43,15.24 13.97,17.78 16.51,17.78 E23.11
N$18
  Top 0.254: E18.5 45.09,43.81 43.81,45.09 43.81,51.44 45.09,52.7 E18.1
N$19
  Top 0.254: R1.1 40.64,36.2 40.64,37.47 C18.1 40.64,38.73 39.37,40.01 39.37,48.9 40.64,50.16 C21.1
  Bottom 0.254: E18.7 44.45,38.1 41.27,38.1 C18.1
N$20
  Top 0.254: E18.15 53.98,51.44 60.33,57.78 C17.+
  Bottom 0.254: R2.2 58.42,60.33 59.69,59.05 60.33,59.05 C17.+
N$21
  Top 0.254: C18.2 40.64,43.81 40.64,45.09 C21.2
  Bottom 0.254: E18.6 44.45,40.64 41.91,43.18 41.27,43.18 C18.2
N$22
  Top 0.254: E18.14 54.61,48.26 60.33,42.55 C17.-
N$23  (via drill 0.61)
  Top 0.254: v214.63,38.1 219.71,43.18 E2.3
  Bottom 0.254: v214.63,38.1 196.85,38.1 E6.12
N$24
  Top 0.254: E18.4 46.35,45.09 52.7,38.73 E18.10
N$25
  Bottom 0.254: E6.11 196.85,35.56 198.12,34.29 224.79,34.29 227.33,36.83 229.87,36.83 230.5,37.47 230.5,40.01 229.24,40.01 E2.11
N$26
  Bottom 0.254: E6.10 196.85,33.02 197.49,32.38 219.07,32.38 219.71,31.75 225.43,31.75 226.69,33.02 227.33,33.02 E2.8
N$27  (via drill 0.61)
  Top 0.254: v102.23,54.61 95.89,48.26 95.89,41.27 60.33,41.27 58.42,43.18 54.61,43.18 E18.12 | v155.57,54.61 156.84,53.34 156.84,48.9 E10.1
  Bottom 0.254: v102.23,54.61 v155.57,54.61
N$28  (via drill 0.61)
  Top 0.254: v123.19,83.19 123.19,69.85 125.73,67.31 125.73,43.18 128.27,40.64 E16.13
  Bottom 0.254: v123.19,83.19 122.56,83.82 114.3,83.82 112.39,85.72 E15.7
N$29
  Top 0.254: E16.12 128.91,38.73 124.46,43.18 124.46,56.52 115.57,65.41 115.57,83.82 114.3,85.09 E15.6
N$30  (via drill 0.61)
  Top 0.254: v140.97,68.58 140.97,58.42 132.72,50.16 132.72,38.73 130.18,36.2 E16.11
  Bottom 0.254: v140.97,68.58 114.3,68.58 112.39,70.48 E15.4
N$31
  Top 0.254: E16.10 128.91,33.66 123.83,38.73 123.83,48.9 113.03,59.69 106.68,59.69 106.68,69.85 E15.2
N$32  (via drill 0.61)
  Top 0.254: v107.31,39.37 106.05,40.64 106.05,67.94 104.14,69.85 E15.1
  Bottom 0.254: v107.31,39.37 133.35,39.37 133.35,34.29 130.18,31.11 E16.9
N$33
  Top 0.254: E16.15 128.91,46.35 127.64,47.62 127.64,67.94 125.73,69.85 125.73,82.55 123.19,85.09 123.19,87.63 122.56,88.27 106.68,88.27 106.68,87.63 E15.9
N$34  (via drill 0.61)
  Top 0.254: v128.27,78.74 128.27,69.85 131.44,66.67 131.44,45.09 130.18,43.81 E16.14
  Bottom 0.254: v128.27,78.74 125.09,81.92 108.58,81.92 104.78,85.72 E15.10
N$35  (via drill 0.61)
  Top 0.254: v71.75,78.74 80.64,69.85 93.98,69.85 93.98,69.22 R24.1 93.98,67.94 93.98,66.67 R37.1
  Bottom 0.254: v71.75,78.74 54.61,78.74 E19.12
N$36
  Top 0.254: R25.1 88.9,67.94 88.9,66.67 R36.1
  Bottom 0.254: E19.10 54.61,73.66 55.24,73.03 81.28,73.03 85.09,69.22 85.09,66.67 88.9,66.67 R36.1
N$37
  Bottom 0.254: E25.11 19.05,76.2 20.32,77.47 33.02,77.47 34.29,76.2 E22.13
N$38  (via drill 0.61)
  Top 0.254: v224.79,46.99 225.43,46.35 225.43,22.86 R39.1
  Bottom 0.254: v224.79,46.99 239.4,46.99 240.66,48.26 D3.A
N$39
  Bottom 0.254: E25.1 11.43,83.82 16.51,78.74 E25.12
N$40
  Top 0.254: R35.1 83.82,66.67 83.82,67.94 R26.1
  Bottom 0.254: E19.8 54.61,68.58 55.88,67.31 81.92,67.31 83.19,68.58 R26.1
N$41
  Bottom 0.254: E22.1 29.21,83.82 30.48,82.55 50.8,82.55 52.07,81.28 E19.13
N$42
  Bottom 0.254: E22.2 29.21,81.28 30.48,80.01 46.99,80.01 50.8,76.2 52.07,76.2 E19.11
N$43
  Top 0.254: E22.3 28.57,79.38 34.29,85.09 51.44,85.09 51.44,73.03 52.7,71.75 E19.9
N$44
  Bottom 0.254: E22.4 29.21,76.2 30.48,74.93 40.64,74.93 44.45,78.74 E19.3
N$45
  Bottom 0.254: E22.5 29.21,73.66 30.48,72.39 43.18,72.39 44.45,73.66 E19.5
N$46
  Top 0.254: R34.1 78.74,66.67 78.74,67.94 R27.1
  Bottom 0.254: E19.4 46.99,76.2 50.8,72.39 74.3,72.39 78.11,68.58 R27.1
N$47
  Top 0.254: Q1.1 109.22,61.59 109.22,69.85 E15.3 109.22,72.39 109.22,85.09 E15.8
N$48
  Top 0.254: Q2.3 162.56,64.14 161.29,65.41 161.29,81.92 163.83,84.45 166.37,84.45 166.37,87.63 162.56,91.44 99.69,91.44 99.69,72.39 96.52,69.22 R29.2
N$49  (via drill 0.61)
  Top 0.254: v135.89,62.23 135.89,60.33 135.25,59.69 133.35,59.69 v133.35,63.5
  Bottom 0.254: v135.89,62.23 147.96,62.23 149.22,63.5 Q3.3 | v133.35,63.5 129.54,67.31 93.34,67.31 92.08,68.58 R30.2
N$50  (via drill 0.61)
  Top 0.254: v135.89,66.04 135.89,65.41 137.16,64.14 Q4.3
  Bottom 0.254: v135.89,66.04 133.99,67.94 99.06,67.94 97.16,69.85 88.27,69.85 87,68.58 R31.2
N$51  (via drill 0.61)
  Top 0.254: v82.55,64.77 81.28,66.04 81.28,67.94 R32.2
  Bottom 0.254: v82.55,64.77 122.56,64.77 123.83,63.5 Q5.3
N$52  (via drill 0.61)
  Top 0.254: v79.38,63.5 76.2,66.67 76.2,67.94 R33.1
  Bottom 0.254: v79.38,63.5 111.12,63.5 Q1.3
N$53
  Bottom 0.254: Q1.2 111.12,60.96 109.22,59.05 77.47,59.05 74.3,55.88 R38.2
N$54  (via drill 0.61)
  Top 0.254: E7.8 205.74,85.09 205.74,72.39 E7.3 205.1,70.48 v201.93,67.31 | Q5.1 121.92,61.59 121.92,69.85 E14.3 121.92,72.39 121.92,85.09 E14.8
  Bottom 0.254: v201.93,67.31 138.43,67.31 133.35,62.23 123.83,62.23 122.56,60.96 Q5.1
N$55
  Bottom 0.254: Q5.2 123.83,60.96 121.28,58.42 81.92,58.42 79.38,55.88 R34.2
N$56  (via drill 0.61)
  Top 0.254: v137.16,57.15 137.16,60.33 Q4.2
  Bottom 0.254: v137.16,57.15 85.72,57.15 84.45,55.88 R35.2
N$57  (via drill 0.61)
  Top 0.254: v132.72,59.05 v135.89,59.05
  Bottom 0.254: v135.89,59.05 147.32,59.05 149.22,60.96 Q3.2 | v132.72,59.05 131.44,57.78 83.82,57.78 82.55,56.52 82.55,54.61 87,54.61 88.27,55.88 R36.2
N$58  (via drill 0.61)
  Top 0.254: v157.48,56.52 161.93,60.96 Q2.2
  Bottom 0.254: v157.48,56.52 137.79,56.52 137.16,55.88 94.61,55.88 R37.2
N$59
  Top 0.254: R38.1 73.66,66.67 73.66,67.94 R28.1
  Bottom 0.254: E19.6 46.99,71.12 48.26,69.85 71.75,69.85 73.03,68.58 R28.1
N$60  (via drill 0.61)
  Top 0.254: 218.44,73.66 218.44,85.09 E5.8 | 218.44,73.66 218.44,72.39 E5.3 | Q4.1 134.62,61.59 134.62,69.85 E12.3 134.62,72.39 134.62,85.09 E12.8 | 218.44,73.66 207.01,73.66 207.01,67.94 v197.49,58.42
  Bottom 0.254: v197.49,58.42 136.53,58.42 135.89,57.78 134.62,59.05 134.62,60.33 Q4.1
N$61  (via drill 0.61)
  Top 0.254: E4.8 231.14,85.09 231.14,72.39 E4.3 230.5,70.48 v224.79,64.77 | Q3.1 147.32,61.59 147.32,69.85 E11.3 147.32,72.39 147.32,85.09 E11.8
  Bottom 0.254: v224.79,64.77 172.72,64.77 170.18,62.23 149.22,62.23 147.96,60.96 Q3.1
N$62
  Top 0.254: E3.3 243.84,72.39 243.84,85.09 E3.8 | Q2.1 160.02,61.59 160.02,69.85 E9.3 160.02,72.39 160.02,85.09 E9.8
  Bottom 0.254: E3.8 243.21,87 241.3,88.9 191.13,88.9 185.42,83.19 163.19,83.19 160.66,85.72 E9.8
N$63
  Top 0.254: D6.A 210.82,47.62 213.36,45.09 213.36,34.92 223.52,24.77 223.52,23.5 R40.1
N$64  (via drill 0.61)
  Top 0.254: v233.68,23.5 240.66,30.48 D2.A
  Bottom 0.254: v233.68,23.5 233.04,24.13 230.5,24.13 229.24,22.86 R41.1
N$65
  Top 0.254: D5.A 211.46,30.48 217.81,24.13 220.98,24.13 220.98,23.5 R42.1
N$66
  Top 0.254: D7.A 180.34,29.84 180.97,29.21 180.97,25.4 182.88,23.5 R43.1
N$67
  Top 0.254: D1.A 240.66,12.7 231.14,22.23 R44.1
N$68
  Top 0.254: D4.A 210.82,13.34 218.44,20.95 218.44,22.23 R45.1
N$69
  Top 0.254: D8.A 180.34,47.62 181.61,46.35 181.61,27.3 185.42,23.5 R46.1
N$70  (via drill 0.61)
  Top 0.254: v172.72,77.47 173.35,76.83 173.35,53.34 177.8,48.9 D8.K
  Bottom 0.254: v172.72,77.47 50.8,77.47 46.99,81.28 E19.2
N$71  (via drill 0.61)
  Top 0.254: v95.89,40.01 96.52,39.37 v96.52,12.06
  Bottom 0.254: v95.89,40.01 103.5,47.62 E17.1 | v96.52,12.06 102.87,5.71 175.26,5.71 180.97,11.43 206.38,11.43 207.65,12.7 D4.K
N$72  (via drill 0.61)
  Top 0.254: v166.37,21.59 169.54,18.41 v169.54,15.24
  Bottom 0.254: v166.37,21.59 91.44,21.59 91.44,33.02 103.5,45.09 E17.2 | v169.54,15.24 233.68,15.24 236.22,12.7 238.12,12.7 D1.K
N$73  (via drill 0.61)
  Top 0.254: v107.31,40.64 108.58,39.37 v108.58,27.94 | v175.26,25.4 177.8,27.94 177.8,29.84 D7.K
  Bottom 0.254: v107.31,40.64 106.68,40.64 104.78,42.55 E17.3 | v108.58,27.94 111.12,25.4 v175.26,25.4
N$74  (via drill 0.61)
  Top 0.254: v102.23,52.07 102.23,42.55 103.5,41.27 E17.4 | v198.12,52.07 208.28,41.91 208.28,31.11 D5.K
  Bottom 0.254: v102.23,52.07 v198.12,52.07
N$75  (via drill 0.61)
  Top 0.254: v134.62,17.78 132.08,20.32 v132.08,35.56
  Bottom 0.254: v134.62,17.78 168.91,17.78 175.9,24.77 194.94,24.77 195.58,25.4 207.65,25.4 212.09,29.84 218.44,29.84 219.07,29.21 236.85,29.21 238.12,30.48 D2.K | v132.08,35.56 130.81,36.83 106.68,36.83 105.41,38.1 E17.5
N$76  (via drill 0.61)
  Top 0.254: v117.47,34.29 117.47,45.09 116.84,45.72 v116.84,50.8
  Bottom 0.254: v117.47,34.29 106.68,34.29 105.41,35.56 E17.6 | v116.84,50.8 117.47,51.44 197.49,51.44 200.66,48.26 207.65,48.26 D6.K
N$77  (via drill 0.61)
  Top 0.254: v118.11,31.75 118.11,6.35 120.65,3.81 177.16,3.81 177.16,7.62 180.97,11.43 229.87,11.43 229.87,26.04 238.76,34.92 238.76,47.62 D3.K
  Bottom 0.254: v118.11,31.75 106.68,31.75 105.41,33.02 E17.7
NUM
  Bottom 0.254: E20.10 36.83,15.24 37.47,15.88 100.33,15.88 102.87,13.34 114.94,13.34 116.2,14.61 J2.11
RUN
  Top 0.254: E2.2 220.34,46.35 219.07,47.62 219.07,50.8 220.98,52.7 R9.1 | RUN.1 376.56,6.35 376.56,16.51 RUN.2
  Bottom 0.254: R9.1 221.62,53.34 222.88,54.61 238.76,54.61 240.03,53.34 358.77,53.34 377.82,34.29 377.82,19.05 376.56,19.05 RUN.2
VCC  (via drill 0.61)
  Top 0.635: R29.1 95.89,78.74 94.61,78.74 R24.2 93.34,78.74 92.08,78.74 R30.1 90.81,78.74 89.53,78.74 R25.2 88.27,78.74 87,78.74 R31.1 85.72,78.74 84.45,78.74 R26.2 83.19,78.74 81.92,78.74 R32.1 80.64,78.74 79.38,78.74 R27.2 78.11,78.74 76.83,78.74 R33.2 75.56,78.74 74.3,78.74 R28.2 73.66,79.38 73.66,83.82 54.61,83.82 E19.14 53.98,83.19 55.24,81.92 55.24,67.31 48.9,60.96 R2.1 | C20.+ 85.09,50.16 92.71,50.16 C19.+ | E21.14 34.92,53.98 34.29,54.61 34.29,62.87 C13.1 | R2.1 48.26,61.59 52.07,65.41 C10.1 | E18.3 46.99,48.26 52.07,53.34 E18.16 52.7,53.98 52.7,55.88 48.26,60.33 R2.1 | E24.2 9.53,50.16 9.53,48.9 E24.3 9.53,47.62 9.53,46.35 E24.4 9.53,45.09 9.53,43.81 E24.5 11.43,43.18 16.51,38.1 E24.8 17.14,37.47 16.51,36.83 16.51,36.2 C15.1 16.51,34.92 16.51,26.67 17.14,26.04 E23.14 17.14,24.77 15.88,23.5 15.88,18.41 | E24.14 17.14,53.98 17.14,64.77 16.51,65.41 C16.1 16.51,66.67 16.51,67.31 10.79,73.03 E25.5 | C12.1 34.29,34.92 34.92,34.29 34.92,26.04 E20.14 | 15.88,13.34 15.88,8.89 16.51,8.26 C14.1 | 15.88,13.34 17.14,14.61 E23.10 | 15.88,18.41 17.14,19.68 E23.12 | 15.88,18.41 15.88,13.34 | E8.16 181.61,81.28 176.53,76.2 E8.3 174.62,75.56 174.62,74.3 E8.4 174.62,73.03 174.62,71.75 E8.5 175.9,70.48 178.44,67.94 178.44,64.77 181.61,61.59 C4.1 181.61,60.33 v181.61,50.16 | 255.27,48.9 255.27,29.84 257.18,27.94 C1.1 | 255.27,48.9 255.91,49.53 258.44,49.53 258.44,48.9 E1.16 | R9.2 221.62,63.5 222.88,63.5 R22.2 224.16,63.5 225.43,63.5 R23.2 | 233.04,55.88 233.04,60.96 231.14,62.87 R21.2 | 233.04,55.88 v233.04,48.26 233.04,30.48 227.97,30.48 C2.1 | 255.27,48.9 253.37,48.9 246.38,55.88 233.04,55.88
  Top 0.635: R4.1 116.84,31.11 116.2,31.75 116.2,43.81 112.39,47.62 E17.16 110.49,48.26 v107.95,50.8 | E13.5 139.06,38.73 139.06,40.01 E13.4 139.06,41.27 139.06,42.55 E13.3 | J2.16 104.78,14.61 106.05,13.34 107.95,13.34 107.95,24.77 110.49,27.3 C8.1 | J1.16 132.08,16.51 128.27,20.32 128.27,27.3 C7.1 128.27,28.57 123.83,33.02 123.83,36.2 122.56,37.47 E16.5 121.28,38.73 121.28,40.01 E16.4 121.28,41.27 121.28,42.55 E16.3 | R45.2 219.07,12.7 220.34,12.7 R42.2 221.62,12.7 222.88,12.7 R40.2 224.16,12.7 225.43,12.7 R39.2 226.69,12.7 227.97,12.7 R41.2 | R18.2 247.01,12.7 248.28,12.7 R17.2 249.56,12.7 250.82,12.7 R16.2 252.09,12.7 253.37,12.7 R15.2 254.63,12.7 255.91,12.7 R14.2 257.18,12.7 258.44,12.7 R13.2 259.71,12.7 260.99,12.7 R11.2 262.25,12.7 263.52,12.7 R12.2 | R43.2 183.51,12.7 184.78,12.7 R46.2 186.06,12.7 187.32,12.7 R3.2 188.59,12.7 189.87,12.7 R5.2 191.13,12.7 192.41,12.7 R7.2 193.68,12.7 194.94,12.7 R6.2 196.22,12.7 197.49,12.7 R8.2 198.12,13.34 200.66,15.88 200.66,43.18 196.22,47.62 E6.16 | C5.1 163.83,29.84 v163.83,26.67 163.83,10.79 161.93,8.89 160.02,8.89 160.02,12.06 R10.2
  Bottom 0.635: E22.16 36.83,83.82 38.1,85.09 50.8,85.09 52.07,83.82 E19.14 | C13.1 34.92,63.5 37.47,60.96 47.62,60.96 R2.1 | C20.+ 82.55,51.44 56.52,51.44 54.61,53.34 E18.16 | E24.2 11.43,50.8 13.97,50.8 16.51,53.34 E24.14 19.05,53.34 20.32,54.61 33.02,54.61 34.29,53.34 E21.14 | E20.14 36.83,25.4 40.01,25.4 R1.2 41.27,25.4 43.81,25.4 51.44,33.02 C9.1 | E23.12 16.51,20.32 13.97,20.32 11.43,17.78 E23.4 9.53,18.41 8.26,18.41 8.26,29.21 VCC.1 | C11.1 33.66,7.62 32.38,6.35 18.41,6.35 17.14,7.62 C14.1 | C12.1 33.66,35.56 32.38,34.29 24.77,34.29 23.5,35.56 17.14,35.56 C15.1 | R9.2 220.34,63.5 219.07,63.5 R19.2 217.81,63.5 216.53,62.23 183.51,62.23 182.25,60.96 C4.1 | R23.2 226.69,63.5 227.97,63.5 R20.2 229.24,63.5 230.5,63.5 R21.2 | v233.04,48.26 229.87,48.26 E2.14 | E16.16 130.81,48.26 134.62,48.26 139.06,43.81 E13.3 138.43,43.18 137.16,41.91 124.46,41.91 123.19,43.18 E16.3 120.65,43.18 118.11,43.18 113.03,48.26 E17.16 | 144.15,26.67 145.41,27.94 C6.1 | 144.15,26.67 130.18,26.67 | 130.18,26.67 128.91,27.94 C7.1 | 144.15,26.67 v163.83,26.67 192.41,26.67 193.68,27.94 C3.1 | 130.18,26.67 112.39,26.67 111.12,27.94 C8.1 | 162.56,49.53 149.86,49.53 148.59,48.26 E13.16 | 162.56,49.53 163.83,48.26 E10.14 | 181.61,49.53 162.56,49.53 | 181.61,49.53 193.04,49.53 194.31,48.26 E6.16 | R41.2 229.24,12.7 230.5,12.7 R44.2 231.78,12.7 233.04,11.43 244.47,11.43 245.75,12.7 R18.2 | R43.2 182.25,12.7 160.66,12.7 R10.2 | R45.2 217.81,12.7 216.53,13.97 200.03,13.97 198.75,12.7 R8.2 | 181.61,49.53 v181.61,50.16 | v107.95,50.8 95.25,50.8 C19.+
  pour Bottom (isolate 0.254): 0,0 0,93.98 393.7,93.98 393.7,0

## Text on the board
Top: Revision A | VRS/CEM | PDP-8/A Console, Board 1
Bottom: Warning - VCC Fill | Warning - VCC Fill | Warning - VCC Fill | Revision A | VRS/CEM | PDP-8/A Console, Board 1
tPlace: Revision A
tValues: VRS/CEM | PDP-8/A Console, Board 1